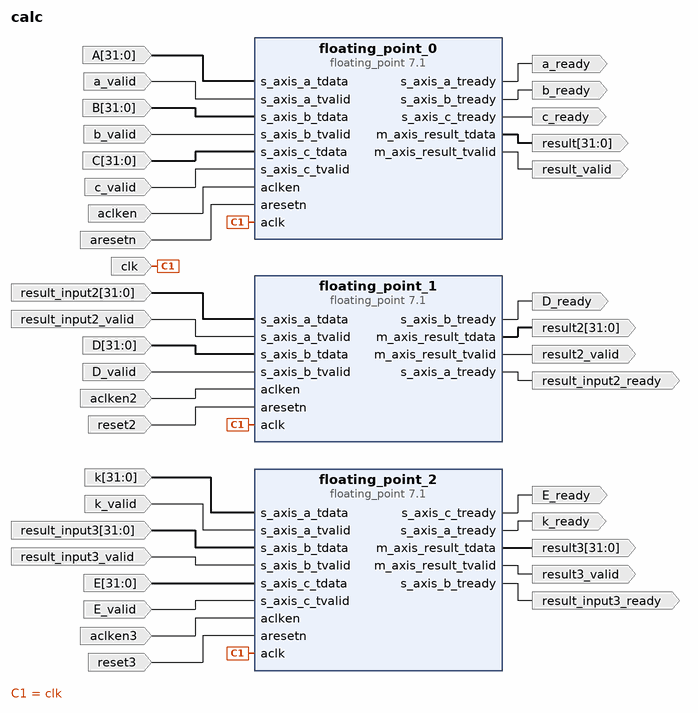
[diagram p0: block diagram of the top level]
# Vivado block design calc, Vivado 2015.4
create_bd_design calc

create_bd_port -dir I -from 31 -to 0 -type data A
create_bd_port -dir I a_valid
create_bd_port -dir I -from 31 -to 0 -type data B
create_bd_port -dir I b_valid
create_bd_port -dir I -from 31 -to 0 -type data C
create_bd_port -dir I c_valid
create_bd_port -dir I -type clk clk
set_property -dict {CONFIG.FREQ_HZ 100000000} [get_bd_ports clk]
create_bd_port -dir O -from 31 -to 0 -type data result
create_bd_port -dir O result_valid
create_bd_port -dir O a_ready
create_bd_port -dir O b_ready
create_bd_port -dir O c_ready
create_bd_port -dir I -type ce aclken
set_property -dict {CONFIG.POLARITY ACTIVE_HIGH} [get_bd_ports aclken]
create_bd_port -dir I -type rst aresetn
create_bd_port -dir I -from 31 -to 0 -type data result_input2
create_bd_port -dir O result_input2_ready
create_bd_port -dir I result_input2_valid
create_bd_port -dir I -from 31 -to 0 -type data D
create_bd_port -dir O D_ready
create_bd_port -dir I D_valid
create_bd_port -dir I -type ce aclken2
set_property -dict {CONFIG.POLARITY ACTIVE_HIGH} [get_bd_ports aclken2]
create_bd_port -dir I -type rst reset2
create_bd_port -dir O -from 31 -to 0 result2
create_bd_port -dir O result2_valid
create_bd_port -dir I -from 31 -to 0 -type data k
create_bd_port -dir O k_ready
create_bd_port -dir I k_valid
create_bd_port -dir I -from 31 -to 0 -type data result_input3
create_bd_port -dir O result_input3_ready
create_bd_port -dir I result_input3_valid
create_bd_port -dir I -from 31 -to 0 -type data E
create_bd_port -dir O E_ready
create_bd_port -dir I E_valid
create_bd_port -dir I -type ce aclken3
set_property -dict {CONFIG.POLARITY ACTIVE_HIGH} [get_bd_ports aclken3]
create_bd_port -dir I -type rst reset3
create_bd_port -dir O -from 31 -to 0 -type data result3
create_bd_port -dir O result3_valid

create_bd_cell -type ip -vlnv xilinx.com:ip:floating_point:7.1 floating_point_0
set_property -dict [list \
  CONFIG.Operation_Type FMA \
  CONFIG.Add_Sub_Value Add \
  CONFIG.Result_Precision_Type Single \
  CONFIG.C_Result_Exponent_Width 8 \
  CONFIG.C_Result_Fraction_Width 24 \
  CONFIG.C_Mult_Usage Full_Usage \
  CONFIG.Axi_Optimize_Goal Performance \
  CONFIG.Has_RESULT_TREADY false \
  CONFIG.Maximum_Latency true \
  CONFIG.C_Latency 20 \
  CONFIG.C_Rate 1 \
  CONFIG.Has_ACLKEN true \
  CONFIG.Has_ARESETn true \
] [get_bd_cells floating_point_0]
create_bd_cell -type ip -vlnv xilinx.com:ip:floating_point:7.1 floating_point_1
set_property -dict [list \
  CONFIG.Add_Sub_Value Add \
  CONFIG.Axi_Optimize_Goal Performance \
  CONFIG.Has_RESULT_TREADY false \
  CONFIG.C_Latency 12 \
  CONFIG.Has_ACLKEN true \
  CONFIG.Has_ARESETn true \
] [get_bd_cells floating_point_1]
create_bd_cell -type ip -vlnv xilinx.com:ip:floating_point:7.1 floating_point_2
set_property -dict [list \
  CONFIG.Operation_Type FMA \
  CONFIG.Add_Sub_Value Add \
  CONFIG.Result_Precision_Type Single \
  CONFIG.C_Result_Exponent_Width 8 \
  CONFIG.C_Result_Fraction_Width 24 \
  CONFIG.C_Mult_Usage Full_Usage \
  CONFIG.Axi_Optimize_Goal Performance \
  CONFIG.Has_RESULT_TREADY false \
  CONFIG.C_Latency 20 \
  CONFIG.C_Rate 1 \
  CONFIG.Has_ACLKEN true \
  CONFIG.Has_ARESETn true \
] [get_bd_cells floating_point_2]

# ---- connections ----

connect_bd_net [get_bd_ports A] [get_bd_pins floating_point_0/s_axis_a_tdata]
connect_bd_net [get_bd_ports a_valid] [get_bd_pins floating_point_0/s_axis_a_tvalid]
connect_bd_net [get_bd_ports B] [get_bd_pins floating_point_0/s_axis_b_tdata]
connect_bd_net [get_bd_ports b_valid] [get_bd_pins floating_point_0/s_axis_b_tvalid]
connect_bd_net [get_bd_ports C] [get_bd_pins floating_point_0/s_axis_c_tdata]
connect_bd_net [get_bd_ports c_valid] [get_bd_pins floating_point_0/s_axis_c_tvalid]
connect_bd_net [get_bd_ports clk] [get_bd_pins floating_point_0/aclk] [get_bd_pins floating_point_1/aclk] [get_bd_pins floating_point_2/aclk]
connect_bd_net [get_bd_pins floating_point_0/m_axis_result_tdata] [get_bd_ports result]
connect_bd_net [get_bd_pins floating_point_0/m_axis_result_tvalid] [get_bd_ports result_valid]
connect_bd_net [get_bd_pins floating_point_0/s_axis_a_tready] [get_bd_ports a_ready]
connect_bd_net [get_bd_pins floating_point_0/s_axis_b_tready] [get_bd_ports b_ready]
connect_bd_net [get_bd_pins floating_point_0/s_axis_c_tready] [get_bd_ports c_ready]
connect_bd_net [get_bd_ports aclken] [get_bd_pins floating_point_0/aclken]
connect_bd_net [get_bd_ports aresetn] [get_bd_pins floating_point_0/aresetn]
connect_bd_net -net result_input2_1 [get_bd_ports result_input2] [get_bd_pins floating_point_1/s_axis_a_tdata]
connect_bd_net [get_bd_pins floating_point_1/s_axis_a_tready] [get_bd_ports result_input2_ready]
connect_bd_net -net result_input_valid2_1 [get_bd_ports result_input2_valid] [get_bd_pins floating_point_1/s_axis_a_tvalid]
connect_bd_net [get_bd_ports D] [get_bd_pins floating_point_1/s_axis_b_tdata]
connect_bd_net [get_bd_pins floating_point_1/s_axis_b_tready] [get_bd_ports D_ready]
connect_bd_net [get_bd_ports D_valid] [get_bd_pins floating_point_1/s_axis_b_tvalid]
connect_bd_net -net aclken2_1 [get_bd_ports aclken2] [get_bd_pins floating_point_1/aclken]
connect_bd_net -net reset2_1 [get_bd_ports reset2] [get_bd_pins floating_point_1/aresetn]
connect_bd_net [get_bd_pins floating_point_1/m_axis_result_tdata] [get_bd_ports result2]
connect_bd_net [get_bd_pins floating_point_1/m_axis_result_tvalid] [get_bd_ports result2_valid]
connect_bd_net [get_bd_ports k] [get_bd_pins floating_point_2/s_axis_a_tdata]
connect_bd_net [get_bd_pins floating_point_2/s_axis_a_tready] [get_bd_ports k_ready]
connect_bd_net [get_bd_ports k_valid] [get_bd_pins floating_point_2/s_axis_a_tvalid]
connect_bd_net -net result_input3_1 [get_bd_ports result_input3] [get_bd_pins floating_point_2/s_axis_b_tdata]
connect_bd_net [get_bd_pins floating_point_2/s_axis_b_tready] [get_bd_ports result_input3_ready]
connect_bd_net [get_bd_ports result_input3_valid] [get_bd_pins floating_point_2/s_axis_b_tvalid]
connect_bd_net [get_bd_ports E] [get_bd_pins floating_point_2/s_axis_c_tdata]
connect_bd_net [get_bd_pins floating_point_2/s_axis_c_tready] [get_bd_ports E_ready]
connect_bd_net [get_bd_ports E_valid] [get_bd_pins floating_point_2/s_axis_c_tvalid]
connect_bd_net -net aclken3_1 [get_bd_ports aclken3] [get_bd_pins floating_point_2/aclken]
connect_bd_net -net reset3_1 [get_bd_ports reset3] [get_bd_pins floating_point_2/aresetn]
connect_bd_net [get_bd_pins floating_point_2/m_axis_result_tdata] [get_bd_ports result3]
connect_bd_net [get_bd_pins floating_point_2/m_axis_result_tvalid] [get_bd_ports result3_valid]

validate_bd_design
save_bd_design
